# Altium schematic sheet Analog_Switch_Arrays.SchDoc: Switch_Array_and_ZIF_Socket
size 431 x 279 mm; DrawnBy: Will Mensah; Organization: ORGANIZATION; Address1: ADDRESS 1; Address2: ADDRESS 2; Address3: ADDRESS 3; Address4: ADDRESS 4; Revision: -; SheetNumber: 3; SheetTotal: 6; ENG_APP_DATE: --/--/--; DSN_APP_DATE: --/--/--; CHK_APP_DATE: --/--/--
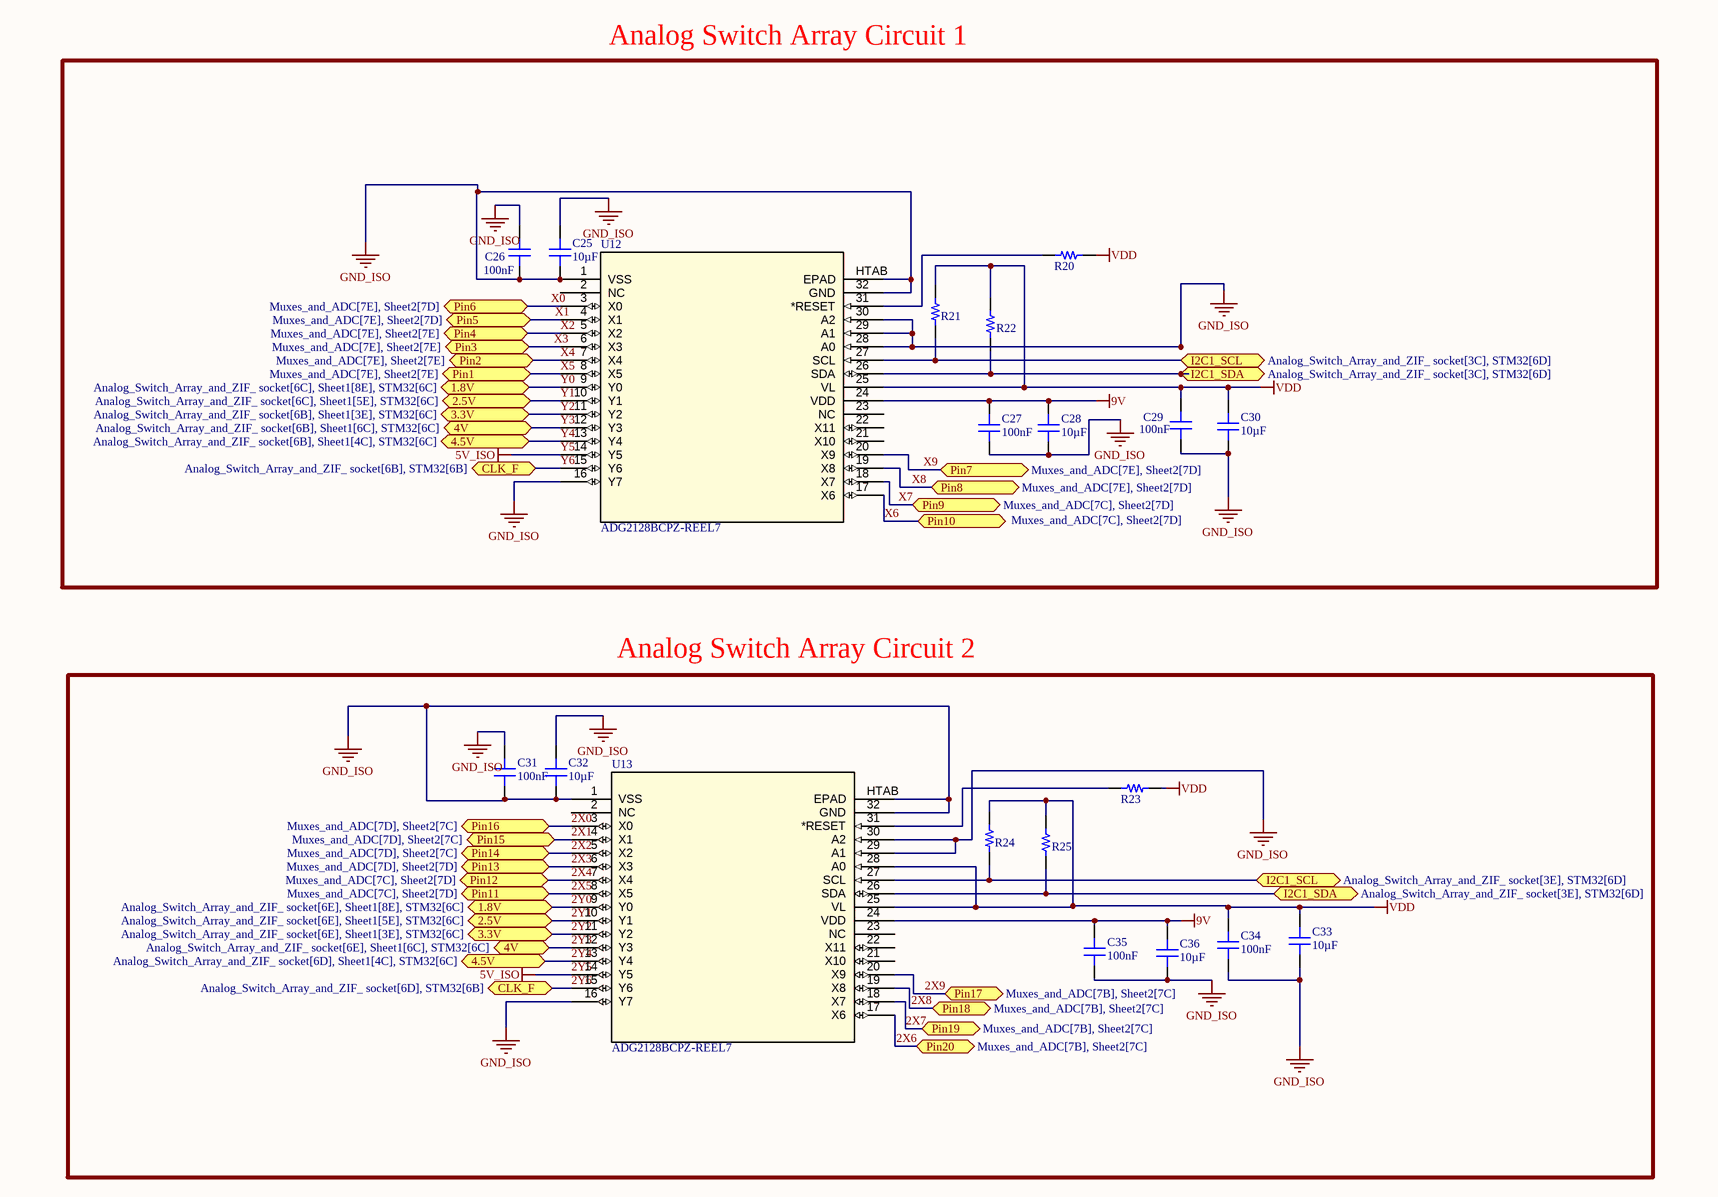
[diagram p0: Analog_Switch_Arrays.SchDoc]

## Parts
C25  value 10µF  [MURATA CAP GCM31M 1206_3216]  (hidden comment: GCM31CM8EG106KE08L)
C26  value 100nF  [CAP 1206_3216 - 0.8MM]  (hidden comment: C1206X104G4HAC7800)
C27  value 100nF  [CAP 1206_3216 - 0.8MM]  (hidden comment: C1206X104G4HAC7800)
C28  value 10µF  [MURATA CAP GCM31M 1206_3216]  (hidden comment: GCM31CM8EG106KE08L)
C29  value 100nF  [CAP 1206_3216 - 0.8MM]  (hidden comment: C1206X104G4HAC7800)
C30  value 10µF  [MURATA CAP GCM31M 1206_3216]  (hidden comment: GCM31CM8EG106KE08L)
C31  value 100nF  [CAP 1206_3216 - 0.8MM]  (hidden comment: C1206X104G4HAC7800)
C32  value 10µF  [MURATA CAP GCM31M 1206_3216]  (hidden comment: GCM31CM8EG106KE08L)
C33  value 10µF  [MURATA CAP GCM31M 1206_3216]  (hidden comment: GCM31CM8EG106KE08L)
C34  value 100nF  [CAP 1206_3216 - 0.8MM]  (hidden comment: C1206X104G4HAC7800)
C35  value 100nF  [CAP 1206_3216 - 0.8MM]  (hidden comment: C1206X104G4HAC7800)
C36  value 10µF  [MURATA CAP GCM31M 1206_3216]  (hidden comment: GCM31CM8EG106KE08L)
R20  RP1206BRD0710KL  [YAGEO RES 1206_3216]  (value not drawn)
R21  SG732ETTD222K  [RES 1210_3225]  (value not drawn)
R22  SG732ETTD222K  [RES 1210_3225]  (value not drawn)
R23  RP1206BRD0710KL  [YAGEO RES 1206_3216]  (value not drawn)
R24  SG732ETTD222K  [RES 1210_3225]  (value not drawn)
R25  SG732ETTD222K  [RES 1210_3225]  (value not drawn)
U12  ADG2128BCPZ-REEL7  [CP_32_7_ADI]
U13  ADG2128BCPZ-REEL7  [CP_32_7_ADI]

## Blocks framed on the sheet
Analog Switch Array Circuit 1: C25-C30 R20-R22 U12
Analog Switch Array Circuit 2: C31-C36 R23-R25 U13

## Ports
1.8V (bidir, see Analog_Switch_Array_and_ZIF_ socket[6C], Sheet1[8E], STM32[6C]), 1.8V (bidir, see Analog_Switch_Array_and_ZIF_ socket[6E], Sheet1[8E], STM32[6C]), 2.5V (bidir, see Analog_Switch_Array_and_ZIF_ socket[6C], Sheet1[5E], STM32[6C]), 2.5V (bidir, see Analog_Switch_Array_and_ZIF_ socket[6E], Sheet1[5E], STM32[6C]), 3.3V (bidir, see Analog_Switch_Array_and_ZIF_ socket[6B], Sheet1[3E], STM32[6C]), 3.3V (bidir, see Analog_Switch_Array_and_ZIF_ socket[6E], Sheet1[3E], STM32[6C]), 4.5V (bidir, see Analog_Switch_Array_and_ZIF_ socket[6B], Sheet1[4C], STM32[6C]), 4.5V (bidir, see Analog_Switch_Array_and_ZIF_ socket[6D], Sheet1[4C], STM32[6C]), 4V (bidir, see Analog_Switch_Array_and_ZIF_ socket[6B], Sheet1[6C], STM32[6C]), 4V (bidir, see Analog_Switch_Array_and_ZIF_ socket[6E], Sheet1[6C], STM32[6C]), CLK_F (bidir, see Analog_Switch_Array_and_ZIF_ socket[6B], STM32[6B]), CLK_F (bidir, see Analog_Switch_Array_and_ZIF_ socket[6D], STM32[6B]), I2C1_SCL (bidir, see Analog_Switch_Array_and_ZIF_ socket[3C], STM32[6D]), I2C1_SCL (bidir, see Analog_Switch_Array_and_ZIF_ socket[3E], STM32[6D]), I2C1_SDA (bidir, see Analog_Switch_Array_and_ZIF_ socket[3C], STM32[6D]), I2C1_SDA (bidir, see Analog_Switch_Array_and_ZIF_ socket[3E], STM32[6D]), Pin1 (bidir, see Muxes_and_ADC[7E], Sheet2[7E]), Pin2 (bidir, see Muxes_and_ADC[7E], Sheet2[7E]), Pin3 (bidir, see Muxes_and_ADC[7E], Sheet2[7E]), Pin4 (bidir, see Muxes_and_ADC[7E], Sheet2[7E]), Pin5 (bidir, see Muxes_and_ADC[7E], Sheet2[7D]), Pin6 (bidir, see Muxes_and_ADC[7E], Sheet2[7D]), Pin7 (bidir, see Muxes_and_ADC[7E], Sheet2[7D]), Pin8 (bidir, see Muxes_and_ADC[7E], Sheet2[7D]), Pin9 (bidir, see Muxes_and_ADC[7C], Sheet2[7D]), Pin10 (bidir, see Muxes_and_ADC[7C], Sheet2[7D]), Pin11 (bidir, see Muxes_and_ADC[7C], Sheet2[7D]), Pin12 (bidir, see Muxes_and_ADC[7C], Sheet2[7D]), Pin13 (bidir, see Muxes_and_ADC[7D], Sheet2[7D]), Pin14 (bidir, see Muxes_and_ADC[7D], Sheet2[7C]), Pin15 (bidir, see Muxes_and_ADC[7D], Sheet2[7C]), Pin16 (bidir, see Muxes_and_ADC[7D], Sheet2[7C]), Pin17 (bidir, see Muxes_and_ADC[7B], Sheet2[7C]), Pin18 (bidir, see Muxes_and_ADC[7B], Sheet2[7C]), Pin19 (bidir, see Muxes_and_ADC[7B], Sheet2[7C]), Pin20 (bidir, see Muxes_and_ADC[7B], Sheet2[7C])

## Nets
2Y5: U12.14(Y5) U13.14(Y5)  [also labelled 5V_ISO, Y5]
9V: C27.2 C28.2 C35.2 C36.2 U12.24(VDD) U13.24(VDD)
GND_ISO: C25.1 C25.2 C26.1 C26.2 C27.1 C28.1 C29.1 C30.1 C31.1 C31.2 C32.1 C32.2 C33.1 C34.1 C35.1 C36.1 U12.1(VSS) U12.16(Y7) U12.28(A0) U12.29(A1) U12.30(A2) U12.32(GND) U12.HTAB(EPAD) U13.1(VSS) U13.16(Y7) U13.29(A1) U13.30(A2) U13.32(GND) U13.HTAB(EPAD)
VDD: C29.2 C30.2 C33.2 C34.2 R20.2 R21.2 R22.2 R23.2 R24.2 R25.2 U12.25(VL) U13.25(VL) U13.28(A0)
2X0: U13.3(X0) ; port Pin16
2X1: U13.4(X1) ; port Pin15
2X2: U13.5(X2) ; port Pin14
2X3: U13.6(X3) ; port Pin13
2X4: U13.7(X4) ; port Pin12
2X5: U13.8(X5) ; port Pin11
2X6: U13.17(X6) ; port Pin20
2X7: U13.18(X7) ; port Pin19
2X8: U13.19(X8) ; port Pin18
2X9: U13.20(X9) ; port Pin17
2Y0: U12.9(Y0) U13.9(Y0) ; port 1.8V  [also labelled Y0]
2Y1: U12.10(Y1) U13.10(Y1) ; port 2.5V  [also labelled Y1]
2Y2: U12.11(Y2) U13.11(Y2) ; port 3.3V  [also labelled Y2]
2Y3: U12.12(Y3) U13.12(Y3) ; port 4V  [also labelled Y3]
2Y4: U12.13(Y4) U13.13(Y4) ; port 4.5V  [also labelled Y4]
2Y6: U12.15(Y6) U13.15(Y6) ; port CLK_F  [also labelled Y6]
I2C1_SCL: R21.1 R24.1 U12.27(SCL) U13.27(SCL) ; port I2C1_SCL
I2C1_SDA: R22.1 R25.1 U12.26(SDA) U13.26(SDA) ; port I2C1_SDA
X0: U12.3(X0) ; port Pin6
X1: U12.4(X1) ; port Pin5
X2: U12.5(X2) ; port Pin4
X3: U12.6(X3) ; port Pin3
X4: U12.7(X4) ; port Pin2
X5: U12.8(X5) ; port Pin1
X6: U12.17(X6) ; port Pin10
X7: U12.18(X7) ; port Pin9
X8: U12.19(X8) ; port Pin8
X9: U12.20(X9) ; port Pin7
NetR20_1: R20.1 U12.31(*RESET)
NetR23_1: R23.1 U13.31(*RESET)

Not connected (* = marked no-connect by the designer): U12 2(NC) 21(X10) 22(X11) 23(NC); U13 2(NC) 21(X10) 22(X11) 23(NC)

## Notes on the sheet
- DWG. NO.
- REV.
- SHT.
- THIS DOCUMENT AND THE DATA DISCLOSED HEREIN OR HEREWITH IS THE PROPERTY OF ALTIUM LIMITED AND MAY BE FREELY DISTRIBUTED IN WHOLE. NO RIGHTS ARE RESERVED OR EXPRESS OR IMPLIED WARANTEE GIVEN.
- REVISION
- DESCRIPTION
- DATE
- APPROVED
- ENG:
- APPROVALS
- PROJECT
- DSN:
- CHK:
- REFERENCE DOCUMENTS
- PROJECT REVISION:
- TITLE
- DOCUMENT REVISION:
- DESIGN ITEM:
- BOM:
- FAB DWG:
- PCB DWG:
- ASSY DWG:
- SCALE:
- SIZE
- B
- CAGE CODE
- FILE NAME
- DWG NO.
- SHEET
- OF
- REV

## Library data of the parts
C25 C28 C30 C32 C33 C36 = CMP-001-063486-1: CAP CER 10UF 35V X8M 1206; Part Number: GCM31CM8EG106KE08L
C26 C27 C29 C31 C34 C35 = CMP-001-063573-1: CAP CER 1206 0.1F 16V ULTRA STAB; Part Number: C1206X104G4HAC7800
R20 R23 = CMP-009-086150-1: RES 10K OHM 0.1% 1/4W 1206; Part Number: RP1206BRD0710KL
R21 R22 R24 R25 = CMP-009-093445-1: RES 2.2K OHM 10% 1/2W 1210; Part Number: SG732ETTD222K
U12 U13 = CMP-011-00018-1: I2C CMOS 8 X 12 Analog Switch Array with Dual/Single Supplies; Manufacturer_Name: Analog Devices Inc; Manufacturer_Part_Number: ADG2128BCPZ-REEL7; Component Type: Standard; Source: ADG2128BCPZ-REEL7.SchLib; Type: Type; Pins: 33; RefDes: RefDes; Copyright: Copyright (C) 2025 Ultra Librarian. All rights reserved.; Design Item ID: ADG2128BCPZ-REEL7